# Altium schematic sheet 05.SchDoc
size 297 x 209 mm
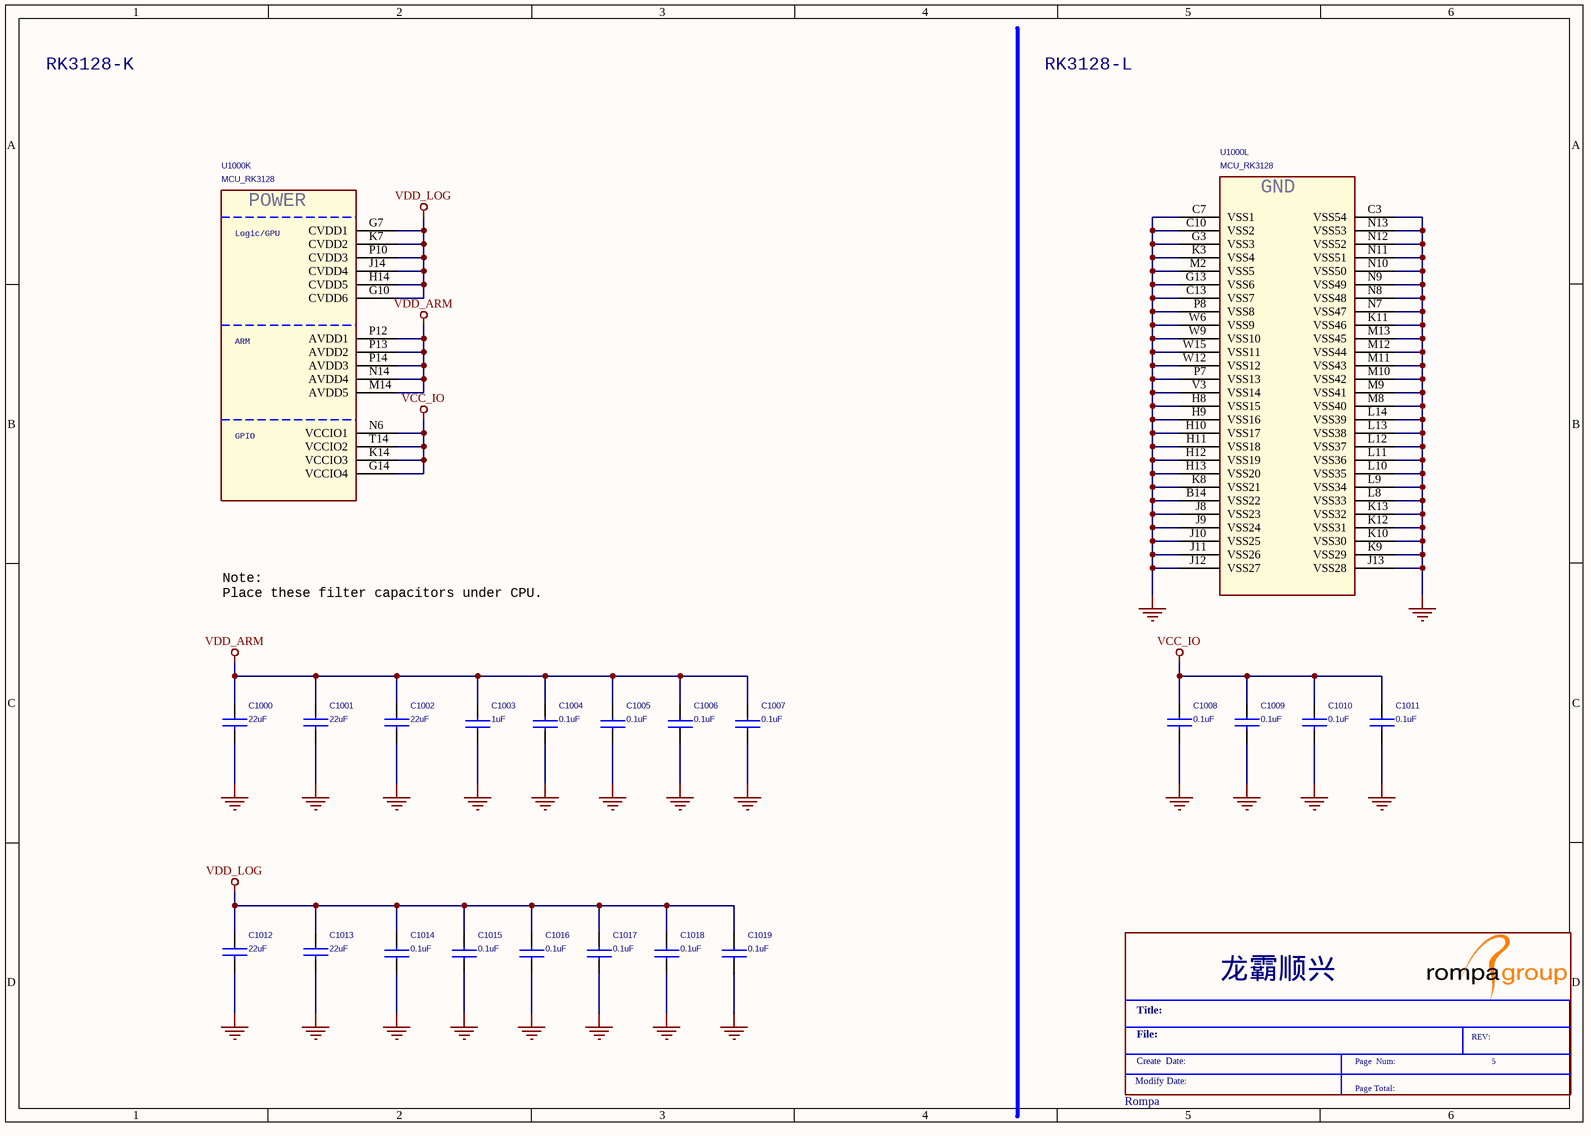
[diagram p0: 05.SchDoc]

## Parts
*  Rompa  Schematic Page Number: 5  (graphical)
C1000  22uF  [C0402]
C1001  22uF  [C0402]
C1002  22uF  [C0402]
C1003  1uF  [C0402]
C1004  0.1uF  [C0402]
C1005  0.1uF  [C0402]
C1006  0.1uF  [C0402]
C1007  0.1uF  [C0402]
C1008  0.1uF  [C0402]
C1009  0.1uF  [C0402]
C1010  0.1uF  [C0402]
C1011  0.1uF  [C0402]
C1012  22uF  [C0402]
C1013  22uF  [C0402]
C1014  0.1uF  [C0402]
C1015  0.1uF  [C0402]
C1016  0.1uF  [C0402]
C1017  0.1uF  [C0402]
C1018  0.1uF  [C0402]
C1019  0.1uF  [C0402]
U1000  MCU_RK3128  [BGA316-14X14-0.65]  (parts K,L of 12)

## Nets
GND: C1000.2 C1001.2 C1002.2 C1003.1 C1004.1 C1005.1 C1006.1 C1007.1 C1008.2 C1009.2 C1010.2 C1011.2 C1012.2 C1013.2 C1014.1 C1015.1 C1016.1 C1017.1 C1018.1 C1019.1 U1000.B14(VSS22) U1000.C3(VSS54) U1000.C7(VSS1) U1000.C10(VSS2) U1000.C13(VSS7) U1000.G3(VSS3) U1000.G13(VSS6) U1000.H8(VSS15) U1000.H9(VSS16) U1000.H10(VSS17) U1000.H11(VSS18) U1000.H12(VSS19) U1000.H13(VSS20) U1000.J8(VSS23) U1000.J9(VSS24) U1000.J10(VSS25) U1000.J11(VSS26) U1000.J12(VSS27) U1000.J13(VSS28) U1000.K3(VSS4) U1000.K8(VSS21) U1000.K9(VSS29) U1000.K10(VSS30) U1000.K11(VSS46) U1000.K12(VSS31) U1000.K13(VSS32) U1000.L8(VSS33) U1000.L9(VSS34) U1000.L10(VSS35) U1000.L11(VSS36) U1000.L12(VSS37) U1000.L13(VSS38) U1000.L14(VSS39) U1000.M2(VSS5) U1000.M8(VSS40) U1000.M9(VSS41) U1000.M10(VSS42) U1000.M11(VSS43) U1000.M12(VSS44) U1000.M13(VSS45) U1000.N7(VSS47) U1000.N8(VSS48) U1000.N9(VSS49) U1000.N10(VSS50) U1000.N11(VSS51) U1000.N12(VSS52) U1000.N13(VSS53) U1000.P7(VSS13) U1000.P8(VSS8) U1000.V3(VSS14) U1000.W6(VSS9) U1000.W9(VSS10) U1000.W12(VSS12) U1000.W15(VSS11)
VCC_IO: C1008.1 C1009.1 C1010.1 C1011.1 U1000.G14(VCCIO4) U1000.K14(VCCIO3) U1000.N6(VCCIO1) U1000.T14(VCCIO2)
VDD_ARM: C1000.1 C1001.1 C1002.1 C1003.2 C1004.2 C1005.2 C1006.2 C1007.2 U1000.M14(AVDD5) U1000.N14(AVDD4) U1000.P12(AVDD1) U1000.P13(AVDD2) U1000.P14(AVDD3)
VDD_LOG: C1012.1 C1013.1 C1014.2 C1015.2 C1016.2 C1017.2 C1018.2 C1019.2 U1000.G7(CVDD1) U1000.G10(CVDD6) U1000.H14(CVDD5) U1000.J14(CVDD4) U1000.K7(CVDD2) U1000.P10(CVDD3)

## Notes on the sheet
- RK3128-K
- RK3128-L
- Note:
  Place these filter capacitors under CPU.
- (in symbol MCU_RK3128, part K) POWER; Logic/GPU; ARM; GPIO
- (in symbol MCU_RK3128, part L) GND
- (in symbol Rompa) 龙霸顺兴; Title:; File:; REV:; Create  Date:; Page  Num:; Modify Date:; Page Total:

## Library data of the parts
C1000-C1002 C1012 C1013 = CAP NP: RoHS CHIP CAP 22uF +10/-10% X5R
C1003 = CAP NP: RoHS CHIP CAP 1uF +10/-10% X5R
C1004-C1011 C1014-C1019 = CAP NP: RoHS CHIP CAP 0.1uF +10/-10% X7R